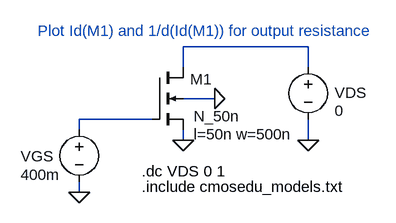
[diagram p0: schematic Fig26_18_ID_VDS.asc]
Fig26_18_ID_VDS.asc, the LTspice schematic file:
Version 4
SHEET 1 1048 680
WIRE 640 80 448 80
WIRE 448 112 448 80
WIRE 640 112 640 80
WIRE 496 160 448 160
WIRE 400 192 288 192
WIRE 288 208 288 192
WIRE 448 224 448 208
WIRE 640 224 640 192
WIRE 288 304 288 288
FLAG 288 304 0
FLAG 448 224 0
FLAG 640 224 0
FLAG 496 160 0
SYMBOL nmos4 400 112 R0
WINDOW 0 59 18 Left 0
WINDOW 3 64 75 Left 0
WINDOW 123 64 103 Left 0
SYMATTR InstName M1
SYMATTR Value N_50n
SYMATTR Value2 l=50n w=500n
SYMBOL voltage 288 192 R0
WINDOW 0 -90 57 Left 0
WINDOW 3 -90 85 Left 0
WINDOW 123 0 0 Left 0
WINDOW 39 0 0 Left 0
SYMATTR InstName VGS
SYMATTR Value 400m
SYMBOL voltage 640 96 R0
WINDOW 0 41 55 Left 0
WINDOW 3 41 83 Left 0
WINDOW 123 0 0 Left 0
WINDOW 39 0 0 Left 0
SYMATTR InstName VDS
SYMATTR Value 0
TEXT 384 272 Left 0 !.dc VDS 0 1 
TEXT 384 296 Left 0 !.include cmosedu_models.txt
TEXT 224 56 Left 0 ;Plot Id(M1) and 1/d(Id(M1)) for output resistance

The netlist it stands for:
* Fig26_18_ID_VDS.asc
M1 N001 N002 0 0 N_50n l=50n w=500n
VGS N002 0 400m
VDS N001 0 0
.model NMOS NMOS
.model PMOS PMOS
.lib standard.mos
.dc VDS 0 1
.include cmosedu_models.txt
* Plot Id(M1) and 1/d(Id(M1)) for output resistance
.backanno
.end